# EAGLE design pulse_sensor (EAGLE 7.1.0)
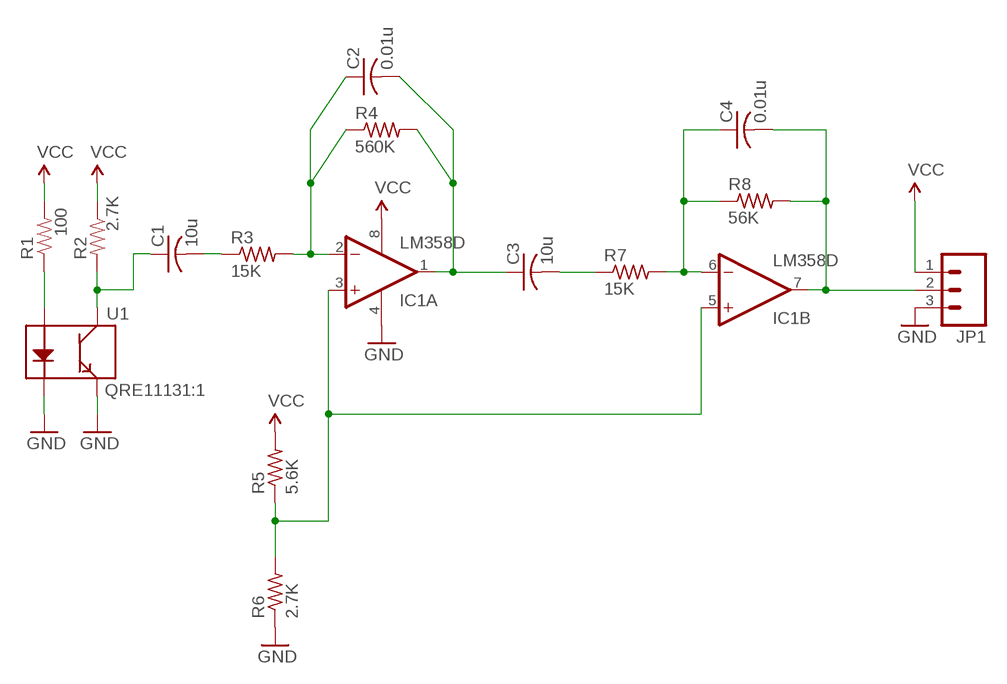
[diagram p0: schematic, sheet 1]

## Parts
C1  10u  C-USC0603  [C0603]
C2  0.01u  C-USC0603  [C0603]
C3  10u  C-USC0603  [C0603]
C4  0.01u  C-USC0603  [C0603]
IC1  LM358D  [SO08]
JP1  M03PTH  [1X03]
R1  100  RESISTOR0603-RES  [0603-RES]
R2  2.7K  RESISTOR0603-RES  [0603-RES]
R3  15K  R-US_R0603  [R0603]
R4  560K  R-US_R0603  [R0603]
R5  5.6K  R-US_R0603  [R0603]
R6  2.7K  R-US_R0603  [R0603]
R7  15K  R-US_R0603  [R0603]
R8  56K  R-US_R0603  [R0603]
U1  QRE11131:1  [QRE1113-1:1]

## Nets
GND: IC1.4(P:V-) JP1.3 R6.1 U1.2(K) U1.4(E)
N$1: R1.1 U1.1(A)
N$2: C2.1 IC1.2(A:-IN) R3.2 R4.1
N$3: C1.2 R3.1
N$4: C2.2 C3.1 IC1.1(A:OUT) R4.2
N$5: C3.2 R7.1
N$6: C4.1 IC1.6(B:-IN) R7.2 R8.1
N$7: C4.2 IC1.7(B:OUT) JP1.2 R8.2
N$9: IC1.3(A:+IN) IC1.5(B:+IN) R5.1 R6.2
OUT: C1.1 R2.2 U1.3(C)
VCC: IC1.8(P:V+) JP1.1 R1.2 R2.1 R5.2

## Library data of the parts
C1-C4 = rcl:C-US: CAPACITOR, American symbol
IC1 = linear:LM358: OP AMP also LM158; LM258; LM2904 Source: http://cache.national.com/ds/LM/LM158.pdf
JP1 = SparkFun:M03: Header 3 Standard 3-pin 0.1" header. Use with straight break away headers (SKU : PRT-00116), right angle break away headers (PRT-00553), swiss pins (PRT-00743), machine pins (PRT-00117), and female headers (PRT-00115). Molex polarized connector foot print use with SKU : PRT-08232 with associated crimp pins and housings.
R1 R2 = SparkFun:RESISTOR: Resistor Basic schematic elements and footprints for 0603, 1206, and PTH 1/10th watt (small) resistors.
R3-R8 = rcl:R-US_: RESISTOR, American symbol
U1 = Testing:QRE1113

## Board
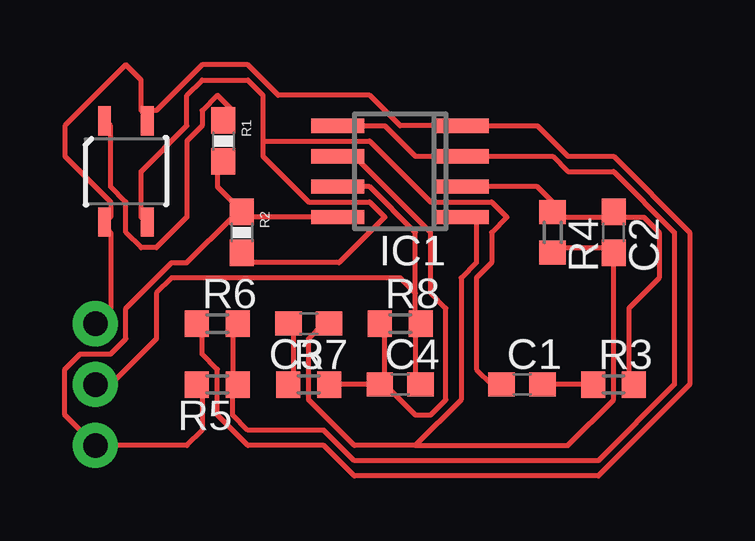
[diagram p1: board, top side]
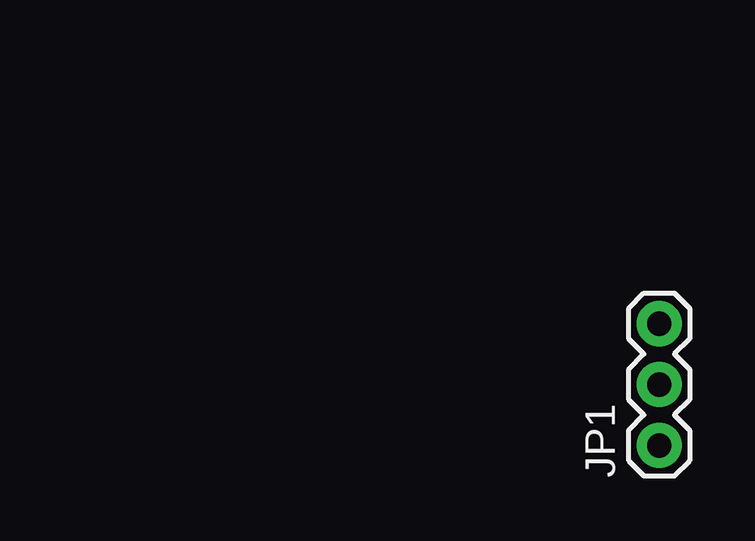
[diagram p2: board, bottom side, seen from below]

No outline drawn. Coordinates in mm, seen from the top.
Copper layers (1*16): Top 0.035mm / dielectric 1.5mm / Bottom 0.035mm
Design rules "SparkFun *": minimum track width 8mil, minimum drill 20mil, track to track 8mil, track to pad 8mil, pad to pad 8mil, via to via 8mil, smd to smd 8mil, copper to edge 9mil, drill to drill 8mil, minimum pad ring 12mil, minimum via ring 10mil, stop-mask expansion 4mil, vias tented up to drill 20mil, thermal gap 10mil

### Footprints (pad centres in the part's own frame; a part is rotated, then mirrored left to right if it is on the bottom)
C0603 = smd 1.1 x 1: 1 -0.85,0; 2 0.85,0
SO08 = smd 0.6 x 2.2: 1 -1.905,-2.6; 2 -0.635,-2.6; 3 0.635,-2.6; 4 1.905,-2.6; 5 1.905,2.6; 6 0.635,2.6; 7 -0.635,2.6; 8 -1.905,2.6
1X03 = drill 1.016 pad 1.88: 1 0,0; 2 2.54,0; 3 5.08,0
0603-RES = smd 1.1 x 1: 1 -0.85,0; 2 0.85,0
R0603 = smd 1 x 1.1: 1 -0.85,0; 2 0.85,0
QRE1113-1:1 = smd 1.219 x 0.533: 1 -2.108,-0.889; 2 2.108,-0.889; 3 2.108,0.889; 4 -2.108,0.889

### Placement (x,y rotation side)
C1  24.13,13.97 0 top
C2  27.94,20.32 270 top
C3  15.24,16.51 180 top
C4  19.05,13.97 0 top
IC1  19.05,22.86 90 top
JP1  6.35,11.43 90 bottom
R1  11.68,24.13 270 top
R2  12.45,20.32 270 top
R3  27.94,13.97 0 top
R4  25.4,20.32 270 top
R5  11.43,13.97 180 top
R6  11.43,16.51 0 top
R7  15.24,13.97 0 top
R8  19.05,16.51 0 top
U1  7.62,22.86 270 top

### Tracks (layer width: path | path; a pad name or v marks a point on that pad's centre or on a via)
GND
  Top 0.203: JP1.3 6.99,17.14 6.99,20.32 U1.2 6.99,20.95 6.99,21.59 5.08,23.5 5.08,24.77 7.62,27.3 8.26,26.67 8.26,25.4 | R6.1 10.79,16.51 10.79,15.24 11.43,14.61 11.43,12.7 12.7,11.43 15.88,11.43 17.14,10.16 27.3,10.16 31.11,13.97 31.11,20.32 27.94,23.5 26.04,23.5 24.77,24.77 IC1.4 19.05,24.77 17.78,26.04 13.97,26.04 12.7,27.3 10.79,27.3 8.89,25.4 8.26,25.4 | 8.26,25.4 U1.4
N$1
  Top 0.203: U1.1 6.99,24.77 6.99,22.23 7.62,21.59 7.62,20.32 8.26,19.68 8.89,19.68 10.16,20.95 10.16,24.13 10.79,24.77 10.79,25.4 11.43,26.04 12.06,25.4 R1.1
N$2
  Top 0.203: 27.94,20.95 25.4,20.95 R4.1 25.4,21.59 24.77,22.23 IC1.2 | 27.94,20.95 29.21,20.95 29.84,20.32 29.84,18.41 28.57,17.14 28.57,13.97 R3.2 | 27.94,20.95 C2.1
N$3
  Top 0.203: R3.1 C1.2
N$4
  Top 0.203: R4.2 25.4,19.68 27.94,19.68 C2.2 27.94,13.34 26.04,11.43 19.68,11.43 | 19.68,11.43 17.14,11.43 15.24,13.34 15.24,15.88 15.88,16.51 C3.1 | 19.68,11.43 21.59,13.34 21.59,18.41 22.23,19.05 22.23,20.95 IC1.1
N$5
  Top 0.203: R7.1 14.61,13.97 14.61,16.51 C3.2
N$6
  Top 0.203: R7.2 C4.1 18.41,13.97 | 18.41,13.97 18.41,16.51 R8.1 | IC1.6 17.14,23.5 20.32,20.32 20.32,17.78 20.95,17.14 20.95,13.34 20.32,12.7 19.68,12.7 18.41,13.97
N$7
  Top 0.203: JP1.2 6.99,13.97 8.89,15.88 8.89,17.78 9.53,18.41 19.05,18.41 19.68,17.78 | 19.68,16.51 19.68,17.78 | 19.68,16.51 19.68,13.97 C4.2 | 19.68,16.51 R8.2 | IC1.7 17.78,22.23 19.68,20.32 19.68,17.78
N$9
  Top 0.203: 12.06,13.97 12.06,16.51 R6.2 | IC1.5 18.41,24.77 19.68,23.5 IC1.3 25.4,23.5 26.04,22.86 27.94,22.86 30.48,20.32 30.48,13.97 27.3,10.79 17.14,10.79 15.88,12.06 12.7,12.06 12.06,12.7 12.06,13.97 | 12.06,13.97 R5.1
OUT
  Top 0.203: 13.34,24.13 13.34,26.04 12.7,26.67 10.79,26.67 10.16,26.04 10.16,24.77 8.26,22.86 8.26,20.95 U1.3 | 13.34,24.13 13.34,23.5 15.24,21.59 17.78,21.59 18.41,20.95 16.51,19.05 12.7,19.05 R2.2 | 13.34,24.13 17.78,24.13 20.32,21.59 22.86,21.59 23.5,20.95 22.86,20.32 22.86,19.05 22.23,18.41 22.23,14.61 22.86,13.97 C1.1
VCC
  Top 0.203: R2.1 12.06,21.59 11.43,22.23 11.43,22.86 R1.2 | IC1.8 12.7,20.95 R2.1 | R5.2 10.79,13.97 10.79,12.06 10.16,11.43 JP1.1 5.08,12.7 5.08,14.61 5.71,15.24 6.99,15.24 7.62,15.88 7.62,17.14 9.53,19.05 10.16,19.05 12.06,20.95 R2.1